# EAGLE design DS1307 DS1338-v12 (EAGLE 6.2)
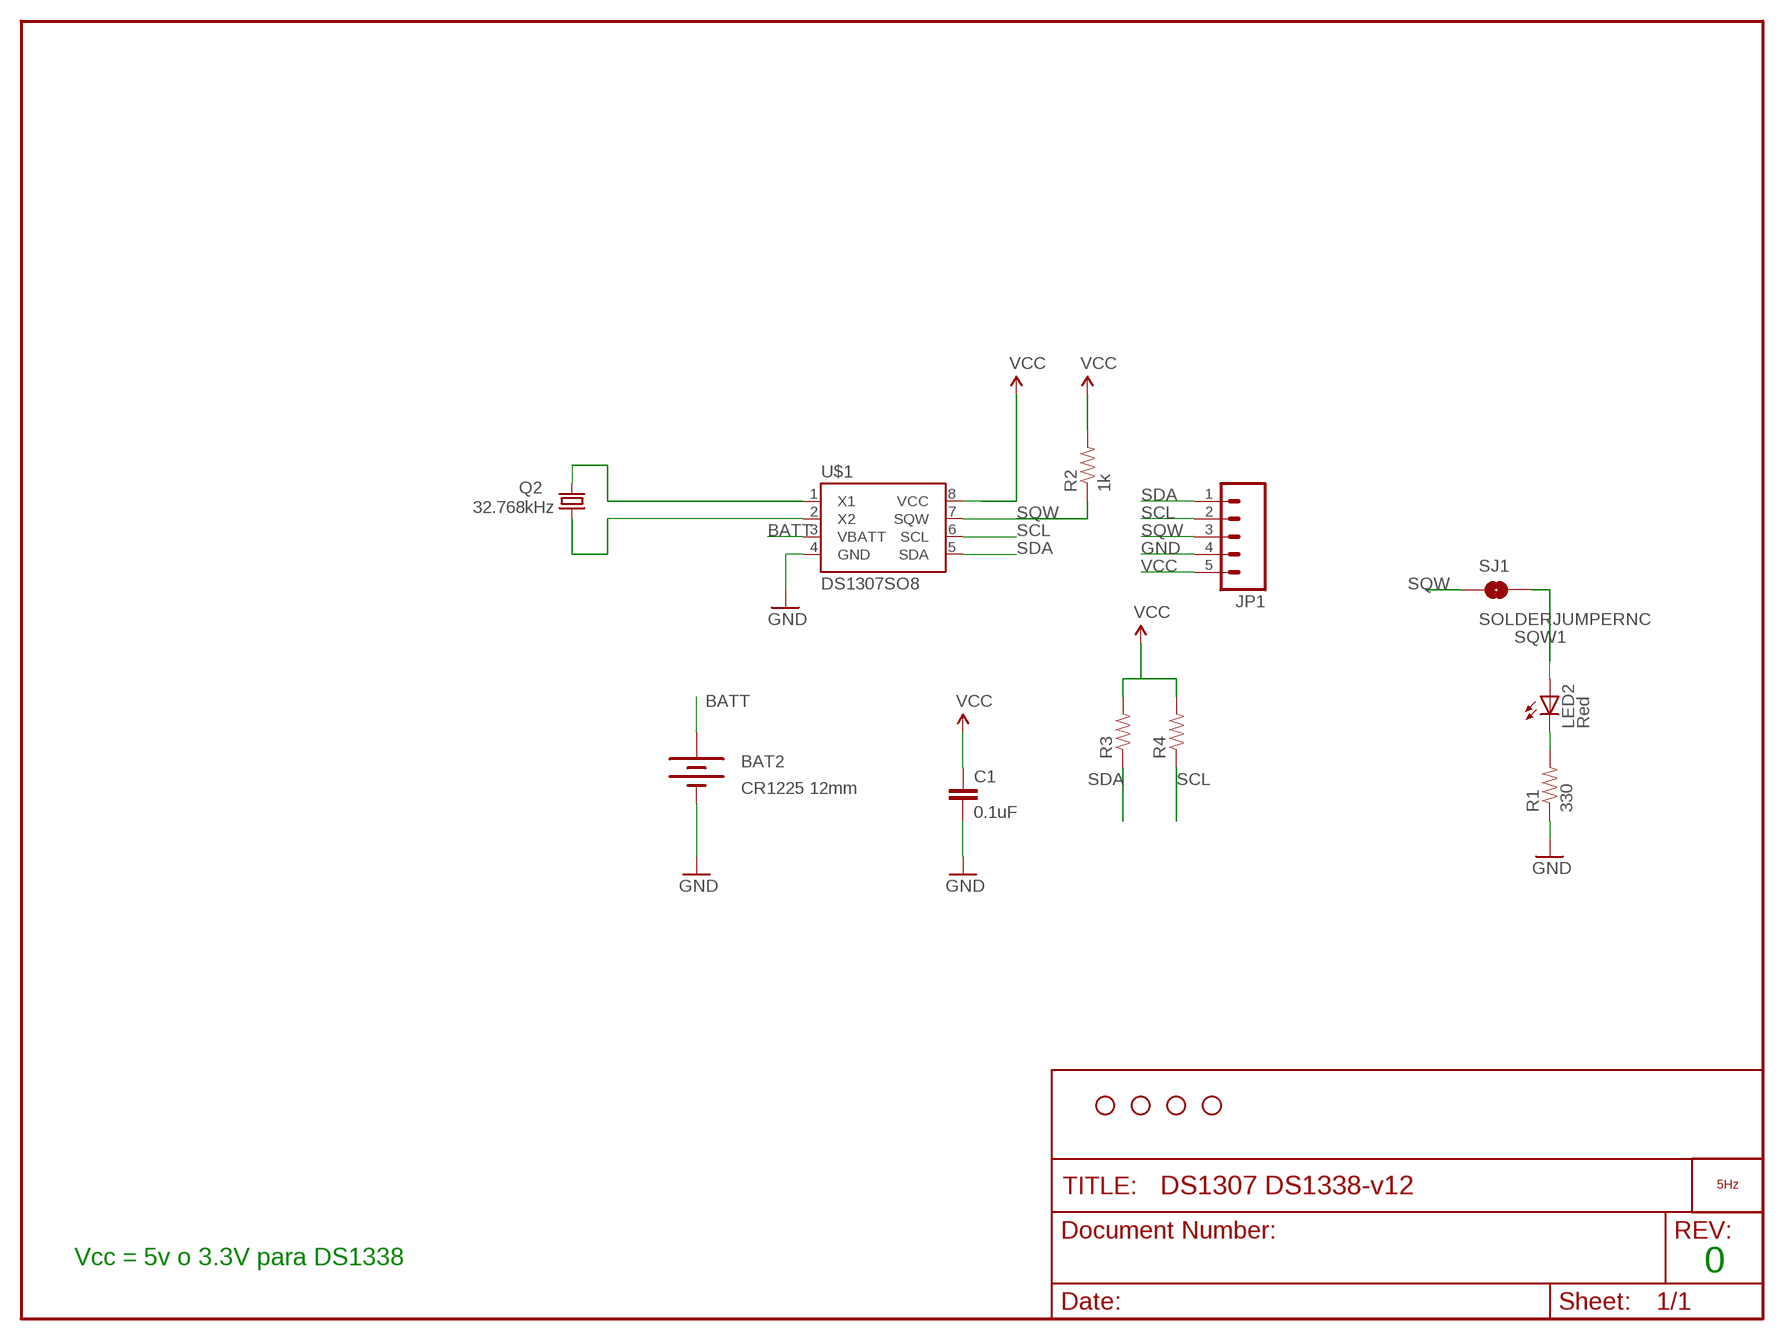
[diagram p0: schematic, sheet 1]

## Parts
BAT2  CR1225 12mm  BATTERY12PTH  [BATTCON_12MM_PTH]
C1  0.1uF  CAP0603-CAP  [0603-CAP]
JP1  M05PTH  [1X05]
JP2  STAND-OFF  [STAND-OFF]
JP3  STAND-OFF  [STAND-OFF]
JP4  STAND-OFF  [STAND-OFF]
JP7  STAND-OFF  [STAND-OFF]
LED2  Red  LED0603  [LED-0603]
LOGO1  LOGO_5HZ_MAIN_5MM  [5HZ_LOGO_MAIN_5MM]
Q2  32.768kHz  CRYSTAL32-SMD  [CRYSTAL-32KHZ-SMD]
R1  330  RESISTOR0603-RES  [0603-RES]
R2  1k  RESISTOR0603-RES  [0603-RES]
R3  RESISTORPTH-1/6W  [1/6W-RES]
R4  RESISTORPTH-1/6W  [1/6W-RES]
SJ1  SOLDERJUMPERNC  [SJ_2S]
U$1  DS1307SO8  [SO08]

## Nets
BATT: BAT2.VCC@1(+) U$1.3(VBATT)
GND: BAT2.GND(-) C1.2 JP1.4 R1.1 U$1.4(GND)
N$1: Q2.X2 U$1.1(X1)
N$2: Q2.X1 U$1.2(X2)
N$30: LED2.C R1.2
SCL: JP1.2 R4.1 U$1.6(SCL)
SDA: JP1.1 R3.1 U$1.5(SDA)
SQW: JP1.3 R2.1 SJ1.1 U$1.7(SQW)
SQW1: LED2.A SJ1.2
VCC: C1.1 JP1.5 R2.2 R3.2 R4.2 U$1.8(VCC)

## Notes on the sheet
- Vcc = 5v o 3.3V para DS1338 | 0

## Library data of the parts
BAT2 = SparkFun:BATTERY: Battery Holders Various common sizes : AA, AAA, 20mm coin cell and 12mm coin cell.
C1 = SparkFun:CAP: Capacitor Standard 0603 ceramic capacitor, and 0.1" leaded capacitor.
JP1 = SparkFun:M05: Header 5 Standard 5-pin 0.1" header. Use with straight break away headers (SKU : PRT-00116), right angle break away headers (PRT-00553), swiss pins (PRT-00743), machine pins (PRT-00117), and female headers (PRT-00115). Molex polarized connector foot print use with SKU : PRT-08230 with associated crimp pins and housings.
JP2-JP4 JP7 = SparkFun:STAND-OFF: Stand Off This is the mechanical footprint for a #4 phillips button head screw. Use the keepout ring to avoid running the screw head into surrounding components. SKU : PRT-00447
LED2 = SparkFun:LED: LEDs Standard schematic elements and footprints for 5mm, 3mm, 1206, and 0603 sized LEDs. 5mm - Spark Fun Electronics SKU : COM-00529 (and others)
LOGO1 = 5hz-electronica:LOGO_5HZ: Logotipo 5Hz "según Pedro"
Q2 = SparkFun:CRYSTAL: Crystals Various standard crystals. Proven footprints. Spark Fun Electronics SKU : COM-00534
R1-R4 = SparkFun:RESISTOR: Resistor Basic schematic elements and footprints for 0603, 1206, and PTH resistors.
SJ1 = SparkFun:SOLDERJUMPER: Solder Jumper Standard SMD solder jumper. Used to automate production. Two varients : Normally Open and Normally Closed are the same, but have different paste layers. NC will have a large amount of paste and should jumper during reflow.
U$1 = SparkFun:DS1307

## Board
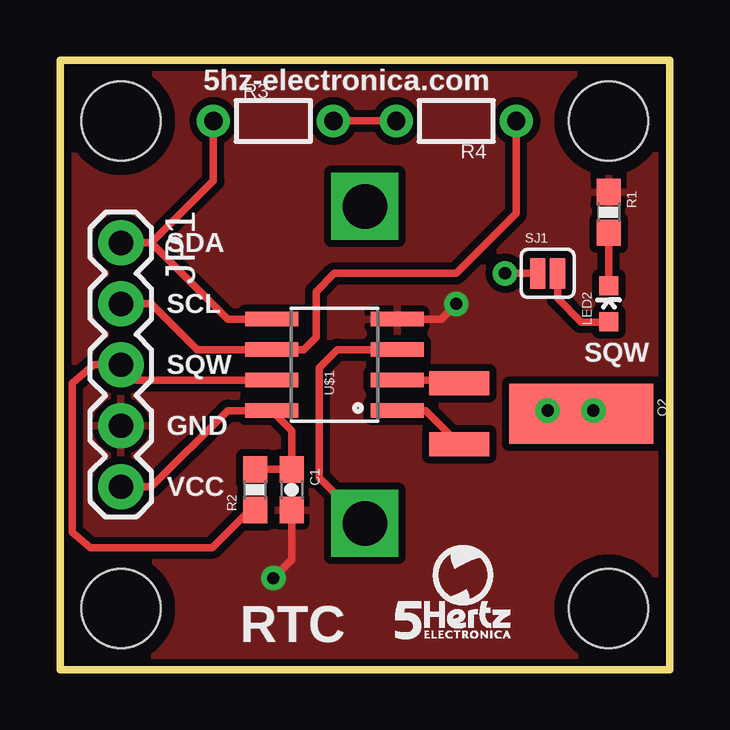
[diagram p1: board, top side]
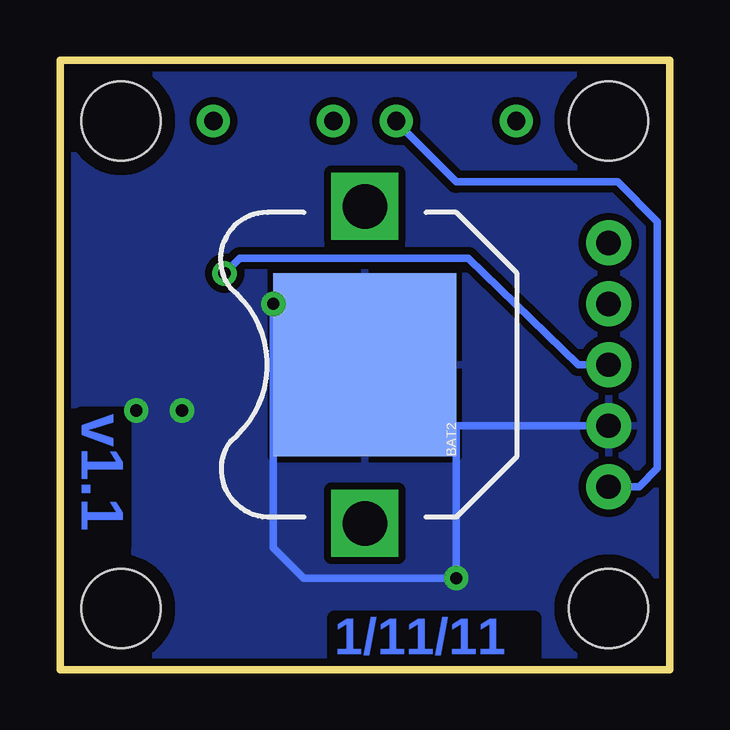
[diagram p2: board, bottom side, seen from below]

Size 25.4 x 25.4 mm. Coordinates in mm from the lower left corner, seen from the top.
Outline: 0,25.4 0,0 25.4,0 25.4,25.4 0,25.4
Copper layers (1*16): Top 0.035mm / dielectric 1.5mm / Bottom 0.035mm
Design rules: minimum track width 8mil, minimum drill 20mil, track to track 8mil, track to pad 8mil, pad to pad 8mil, via to via 8mil, smd to smd 8mil, copper to edge 10mil, drill to drill 8mil, minimum pad ring 12mil, minimum via ring 10mil, stop-mask expansion 4mil, vias tented up to drill 25mil, thermal gap 10mil

### Footprints (pad centres in the part's own frame; a part is rotated, then mirrored left to right if it is on the bottom)
BATTCON_12MM_PTH = smd 7.62 x 7.62: GND 0,0 | drill 1.854 square: VCC@1 -6.604,0; VCC@2 6.604,0
0603-CAP = smd 1.1 x 1: 1 -0.85,0; 2 0.85,0
1X05 = drill 1.016 pad 1.88: 1 0,0; 2 2.54,0; 3 5.08,0; 4 7.62,0; 5 10.16,0
STAND-OFF = hole 3.302: 0,0
LED-0603 = smd 0.8 x 0.8: A 0,-0.75; C 0,0.75
CRYSTAL-32KHZ-SMD = smd 2.5 x 6: SHEILD 0,5.08 | smd 1 x 2.5: X1 -1.27,0; X2 1.27,0
0603-RES = smd 1.1 x 1: 1 -0.85,0; 2 0.85,0
1/6W-RES = drill 0.762: 1 -2.5,0; 2 2.5,0
SJ_2S = smd 0.635 x 1.27: 1 -0.412,0; 2 0.412,0
SO08 = smd 0.61 x 2.21: 1 -1.905,-2.616; 2 -0.635,-2.616; 3 0.635,-2.616; 4 1.905,-2.616; 5 1.905,2.616; 6 0.635,2.616; 7 -0.635,2.616; 8 -1.905,2.616

### Placement (x,y rotation side)
BAT2  12.7,12.7 90 bottom
C1  9.65,7.49 270 top
JP1  2.54,17.78 270 top
JP2  2.54,2.54 0 top
JP3  22.86,2.54 0 top
JP4  22.86,22.86 0 top
JP7  2.54,22.86 0 top
LED2  22.86,15.24 0 top
LOGO1  13.97,1.27 0 top
Q2  16.64,10.67 270 top
R1  22.86,19.05 270 top
R2  8.13,7.49 90 top
R3  8.89,22.86 0 top
R4  16.51,22.86 180 top
SJ1  20.32,16.51 0 top
U$1  11.43,12.7 90 top

### Tracks (layer width: path | path; a pad name or v marks a point on that pad's centre or on a via)
BATT
  Top 0.305: BAT2.VCC@1 10.79,8 10.79,12.57 11.56,13.34 U$1.3
GND  (via drill 0.51)
  Top 0.305: C1.2 9.65,4.57 v8.89,3.81 | U$1.4 15.88,14.61 v16.51,15.24
  Bottom 0.305: 8.89,10.16 JP1.4 | 8.89,10.16 10.16,10.16 BAT2.GND | 8.89,10.16 v8.89,3.81 15.24,3.81 16.51,5.08 v16.51,15.24
  other vias: 20.32,10.79 22.23,10.79
  pour Top (isolate 0.305): 25.4,25.4 0,25.4 0,0 25.4,0
  pour Bottom (isolate 0.305): 0,25.4 0,0 25.4,0 25.4,25.4
N$1
  Top 0.305: U$1.1 15.24,10.79 Q2.X2
N$2
  Top 0.305: U$1.2 16.51,12.06 Q2.X1
N$30
  Top 0.305: LED2.C R1.2
SCL
  Top 0.305: JP1.2 3.81,15.24 5.71,13.34 U$1.6 10.16,13.34 10.67,13.84 10.67,15.75 11.43,16.51 16.51,16.51 19.01,19.01 R4.1
SDA
  Top 0.305: 3.81,17.78 JP1.1 | U$1.5 6.99,14.61 3.81,17.78 | R3.1 6.39,20.36 3.81,17.78
SQW  (via drill 0.51)
  Top 0.305: U$1.7 3.17,12.06 JP1.3 1.4,12.7 0.51,11.94 0.51,5.71 1.27,5.08 6.35,5.08 7.91,6.64 R2.1 | v18.54,16.51 SJ1.1
  Bottom 0.305: JP1.3 3.81,12.7 8.38,17.14 17.91,17.14 v18.54,16.51
SQW1
  Top 0.305: 20.73,16.92 SJ1.2 20.73,15.46 21.72,14.48 22.85,14.48 LED2.A
VCC
  Top 0.305: JP1.5 3.81,7.62 6.99,10.79 U$1.8 9.65,9.96 C1.1 R2.2 | R3.2 R4.2
  Bottom 0.305: R3.2 11.39,22.82 8.89,20.32 2.16,20.32 0.51,18.67 0.51,8.38 1.27,7.62 JP1.5

### Text on the board
Bottom: v1.1 | 1/11/11
tPlace: 5hz-electronica.com | SDA | SCL | SQW | SQW | GND | VCC | RTC
Name: www.5hz-electronica.com | RTC